# EAGLE design plant-sense (EAGLE 9.5.1)
CNAME: PepeTech; CREVISION: 2.0; DESIGNER: Joao Silva

## Sheet 1 of 4: Power
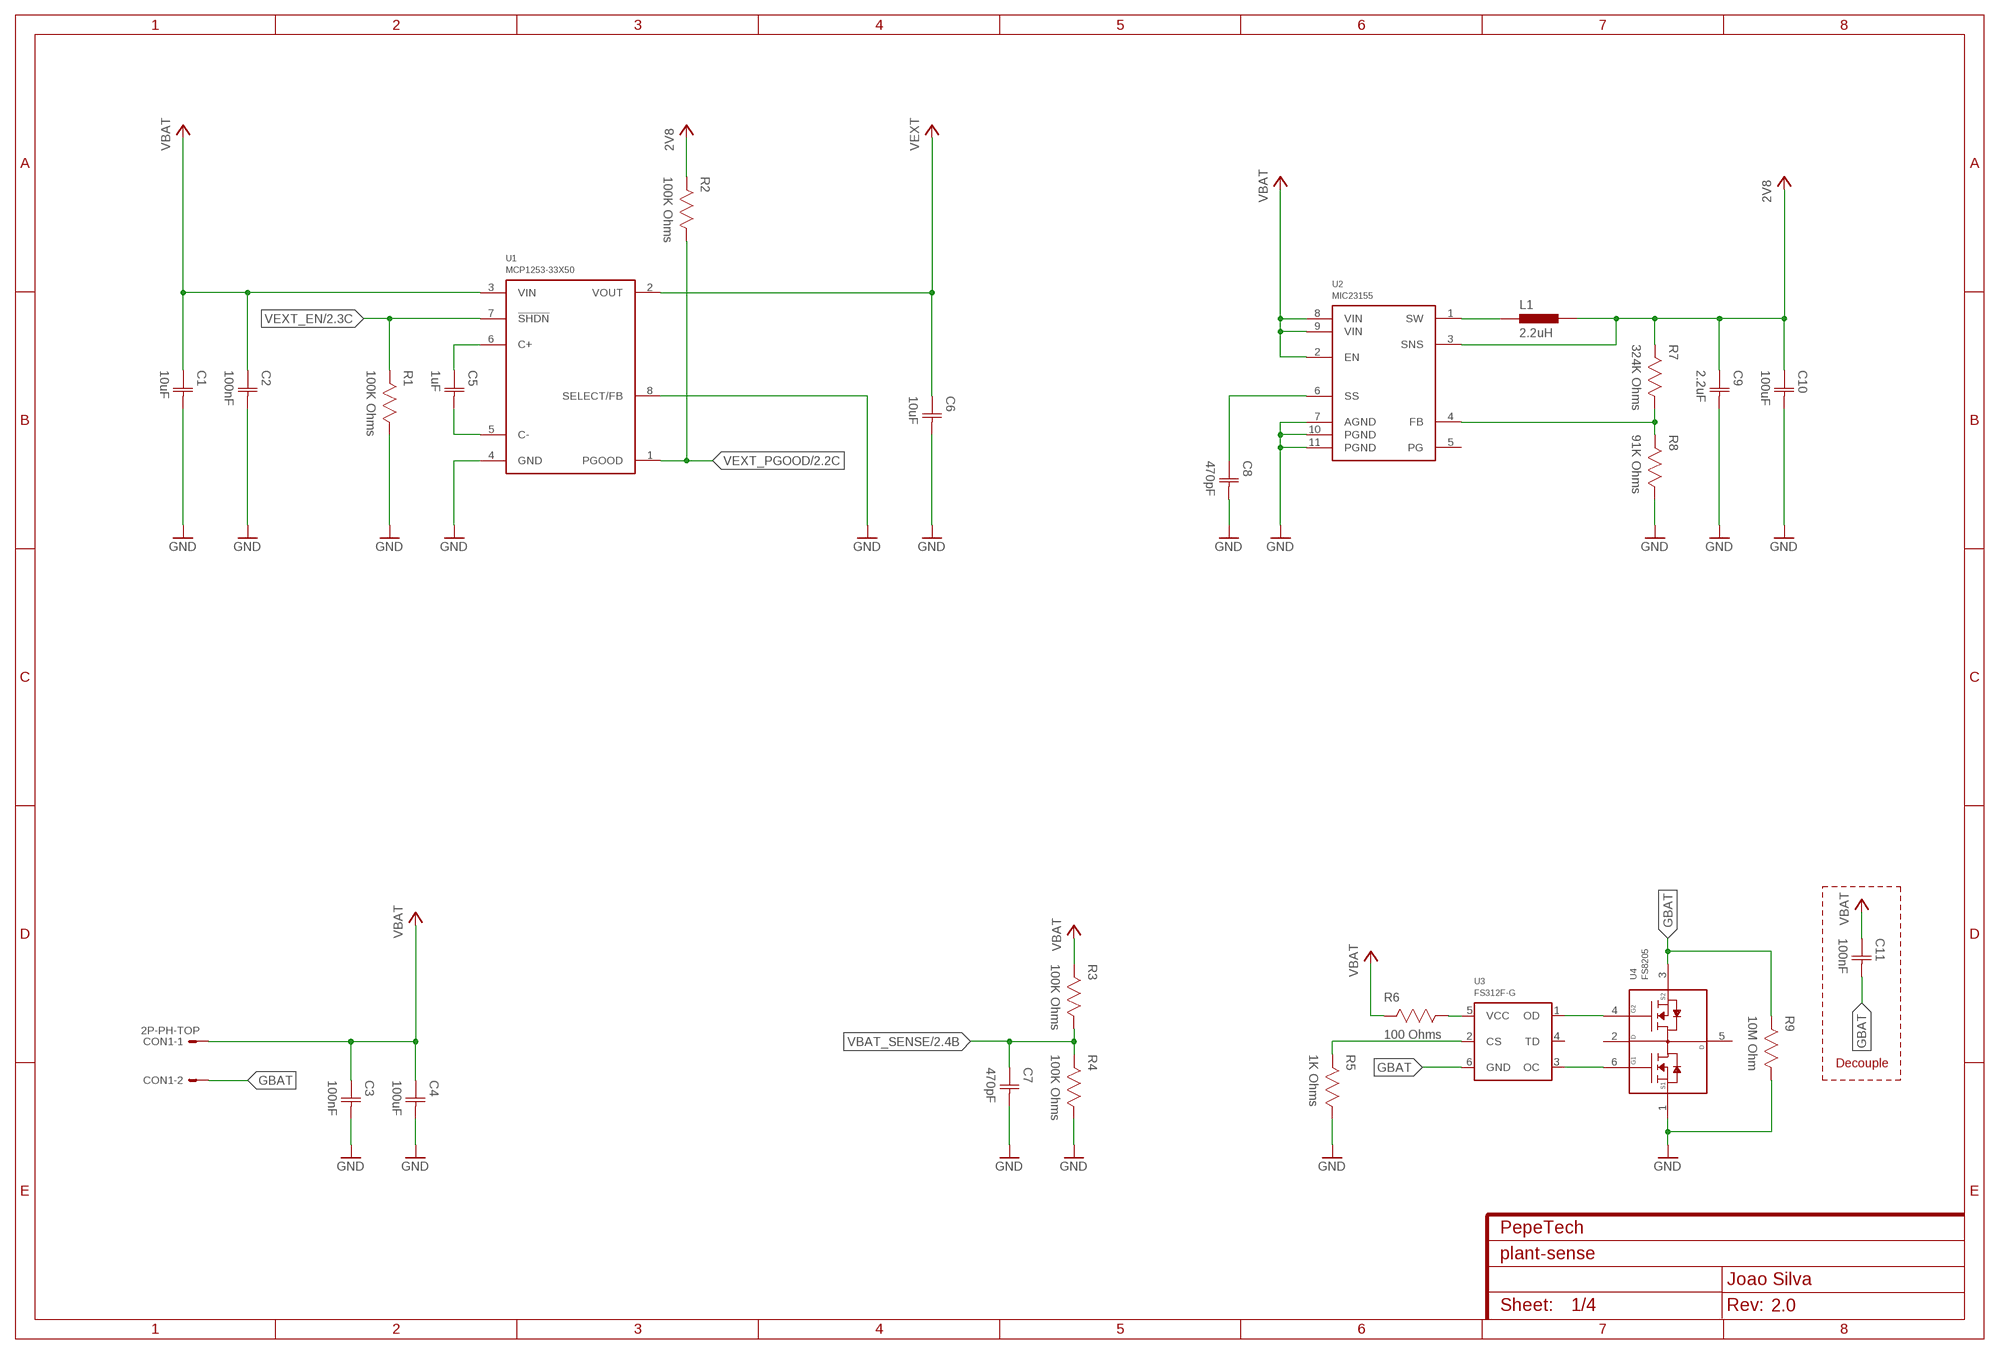
[diagram p0: schematic, sheet 1]

### Parts
C1  10uF  CAPACITOR-0603  [CAP0603]
C2  100nF  CAPACITOR-0603  [CAP0603]
C3  100nF  CAPACITOR-0603  [CAP0603]
C4  100uF  CAPACITOR-1206  [CAP1206]
C5  1uF  CAPACITOR-0603  [CAP0603]
C6  10uF  CAPACITOR-0603  [CAP0603]
C7  470pF  CAPACITOR-0603  [CAP0603]
C8  470pF  CAPACITOR-0603  [CAP0603]
C9  2.2uF  CAPACITOR-0603  [CAP0603]
C10  100uF  CAPACITOR-1206  [CAP1206]
C11  100nF  CAPACITOR-0603  [CAP0603]
CON1  2P-PH-TOP  [PH-02-TOP]
L1  2.2uH  INDUCTOR-0805  [IND0805]
R1  100K Ohms  RESISTOR-0603  [RES0603]
R2  100K Ohms  RESISTOR-0603  [RES0603]
R3  100K Ohms  RESISTOR-0603  [RES0603]
R4  100K Ohms  RESISTOR-0603  [RES0603]
R5  1K Ohms  RESISTOR-0603  [RES0603]
R6  100 Ohms  RESISTOR-0603  [RES0603]
R7  324K Ohms  RESISTOR-0603  [RES0603]
R8  91K Ohms  RESISTOR-0603  [RES0603]
R9  10M Ohm  RESISTOR-0603  [RES0603]
U1  MCP1253-33X50  [MSOP8]
U2  MIC23155  [DFN10]
U3  FS312F-G  [SOT23-6]
U4  FS8205  [SOT23-6]

### Nets
2V8: C9.1(C1) C10.1(C1) L1.2 R2.2 R7.2 U2.3(SNS) ; also sheet 2,3,4
GBAT: C11.2(C2) CON1.2 R9.2 U3.6(GND) U4.3(S2)
GND: C1.2(C2) C2.2(C2) C3.2(C2) C4.2(C2) C6.2(C2) C7.2(C2) C8.2(C2) C9.2(C2) C10.2(C2) R1.1 R4.1 R5.1 R8.1 R9.1 U1.4(GND) U1.8(SELECT/FB) U2.7(AGND) U2.10(PGND) U2.11(PGND) U4.1(S1) ; also sheet 2,3,4
N$2: C5.2(C2) U1.5(C-)
N$6: C5.1(C1) U1.6(C+)
N$12: L1.1 U2.1(SW)
N$13: R7.1 R8.2 U2.4(FB)
N$14: C8.1(C1) U2.6(SS)
N$47: U3.3(OC) U4.6(G1)
N$48: U3.1(OD) U4.4(G2)
N$49: R6.1 U3.5(VCC)
N$50: R5.2 U3.2(CS)
VBAT: C1.1(C1) C2.1(C1) C3.1(C1) C4.1(C1) C11.1(C1) CON1.1 R3.2 R6.2 U1.3(VIN) U2.2(EN) U2.8(VIN) U2.9(VIN)
VBAT_SENSE: C7.1(C1) R3.1 R4.2 ; also sheet 2
VEXT: C6.1(C1) U1.2(VOUT) ; also sheet 4
VEXT_EN: R1.2 U1.7(!SHDN) ; also sheet 2,4
VEXT_PGOOD: R2.1 U1.1(PGOOD) ; also sheet 2
Unconnected: U2.5(PG) U3.4(TD) U4.2(D12_1) U4.5(D12_2)

### Notes on the sheet
- Decouple

## Sheet 2 of 4: Main MCU
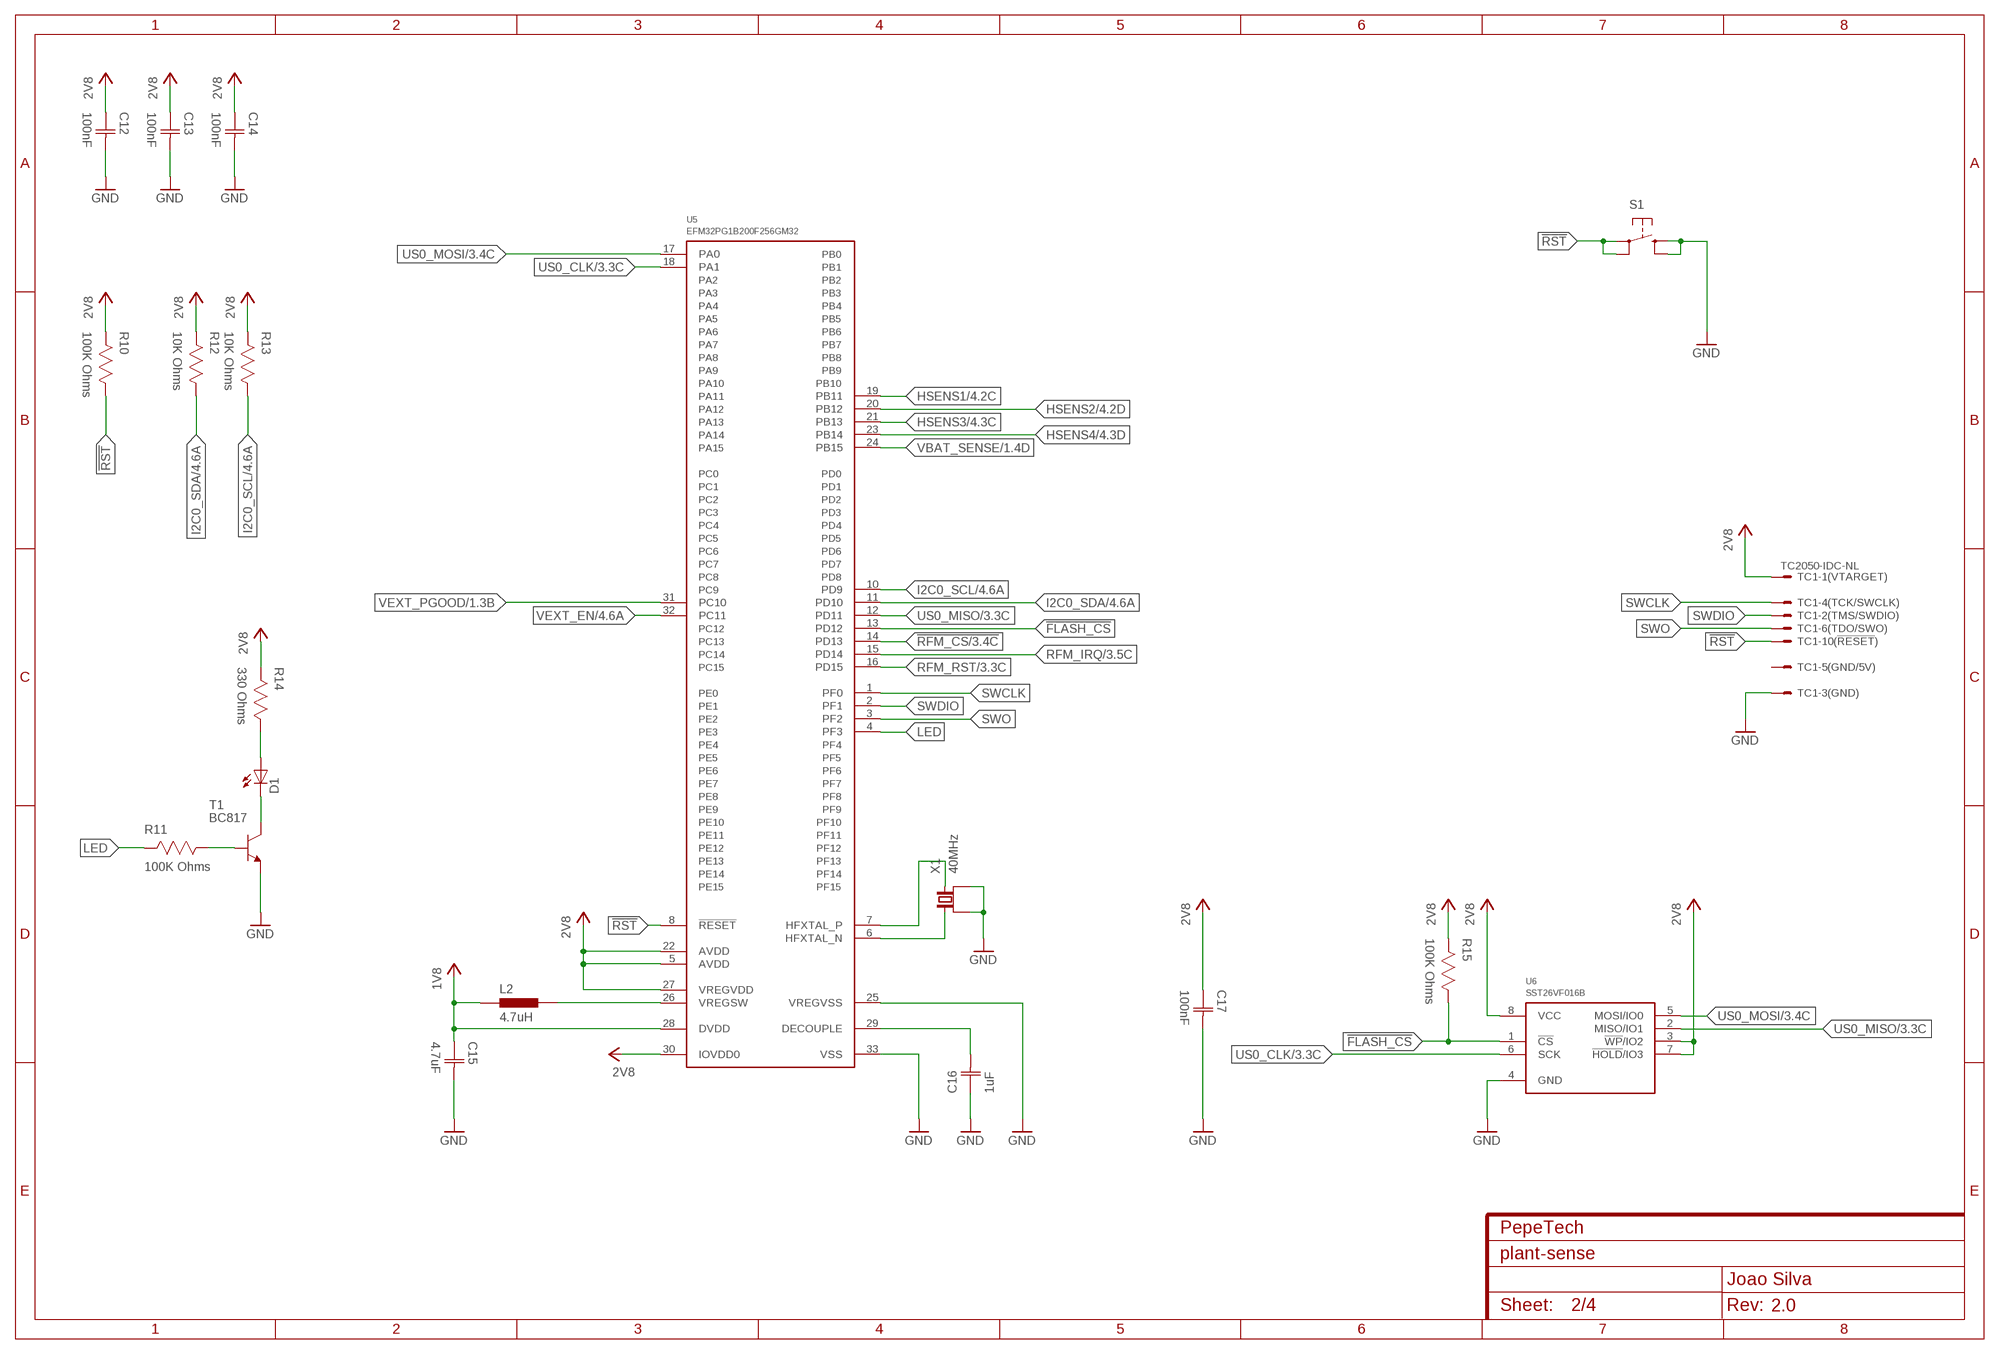
[diagram p1: schematic, sheet 2]

### Parts
C12  100nF  CAPACITOR-0603  [CAP0603]
C13  100nF  CAPACITOR-0603  [CAP0603]
C14  100nF  CAPACITOR-0603  [CAP0603]
C15  4.7uF  CAPACITOR-0603  [CAP0603]
C16  1uF  CAPACITOR-0603  [CAP0603]
C17  100nF  CAPACITOR-0603  [CAP0603]
D1  LED1206  [1206]
L2  4.7uH  INDUCTOR-0603  [IND0603]
R10  100K Ohms  RESISTOR-0603  [RES0603]
R11  100K Ohms  RESISTOR-0603  [RES0603]
R12  10K Ohms  RESISTOR-0603  [RES0603]
R13  10K Ohms  RESISTOR-0603  [RES0603]
R14  330 Ohms  RESISTOR-0603  [RES0603]
R15  100K Ohms  RESISTOR-0603  [RES0603]
S1  TAC_SWITCHSMD  [TAC_SW_SMD_RESET]
T1  BC817  [SOT23]
TC1  TC2050-IDC-NL  [TC2050-IDC-NL]
U5  EFM32PG1B200F256GM32  [QFN32_0.5P]
U6  SST26VF016B  [WSOIC8]
X1  40MHz  CRYSTAL_4P  [4-SMD-3225]

### Nets
1V8: C15.1(C1) L2.1 U5.28(DVDD)
2V8: C12.1(C1) C13.1(C1) C14.1(C1) C17.1(C1) R10.2 R12.2 R13.2 R14.2 R15.2 TC1.1 U5.5(AVDD) U5.22(AVDD) U5.27(VREGVDD) U5.30(IOVDD0) U6.3(!WP!/IO2) U6.7(!HOLD!/IO3) U6.8(VCC) ; also sheet 1,3,4
!FLASH_CS: R15.1 U5.13(PD12) U6.1(!CS!)
!RFM_CS: U5.14(PD13) ; also sheet 3
!RST: R10.1 S1.1 S1.2 TC1.10 U5.8(!RESET)
GND: C12.2(C2) C13.2(C2) C14.2(C2) C15.2(C2) C16.1(C1) C17.2(C2) S1.3 S1.4 T1.2(E) TC1.3 U5.25(VREGVSS) U5.33(VSS) U6.4(GND) X1.1(GND) X1.3(GND) ; also sheet 1,3,4
HSENS1: U5.19(PB11) ; also sheet 4
HSENS2: U5.20(PB12) ; also sheet 4
HSENS3: U5.21(PB13) ; also sheet 4
HSENS4: U5.23(PB14) ; also sheet 4
I2C0_SCL: R13.1 U5.10(PD9) ; also sheet 4
I2C0_SDA: R12.1 U5.11(PD10) ; also sheet 4
LED: R11.2 U5.4(PF3)
N$11: R11.1 T1.1(B)
N$15: D1.C T1.3(C)
N$16: U5.6(HFXTAL_N) X1.2
N$17: U5.7(HFXTAL_P) X1.4
N$18: D1.A R14.1
N$19: L2.2 U5.26(VREGSW)
N$20: C16.2(C2) U5.29(DECOUPLE)
RFM_IRQ: U5.15(PD14) ; also sheet 3
RFM_RST: U5.16(PD15) ; also sheet 3
SWCLK: TC1.4 U5.1(PF0)
SWDIO: TC1.2 U5.2(PF1)
SWO: TC1.6 U5.3(PF2)
US0_CLK: U5.18(PA1) U6.6(SCK) ; also sheet 3
US0_MISO: U5.12(PD11) U6.2(MISO/IO1) ; also sheet 3
US0_MOSI: U5.17(PA0) U6.5(MOSI/IO0) ; also sheet 3
VBAT_SENSE: U5.24(PB15) ; also sheet 1
VEXT_EN: U5.32(PC11) ; also sheet 1,4
VEXT_PGOOD: U5.31(PC10) ; also sheet 1
Unconnected: TC1.5 TC1.7 TC1.8 TC1.9

## Sheet 3 of 4: ISM Radio
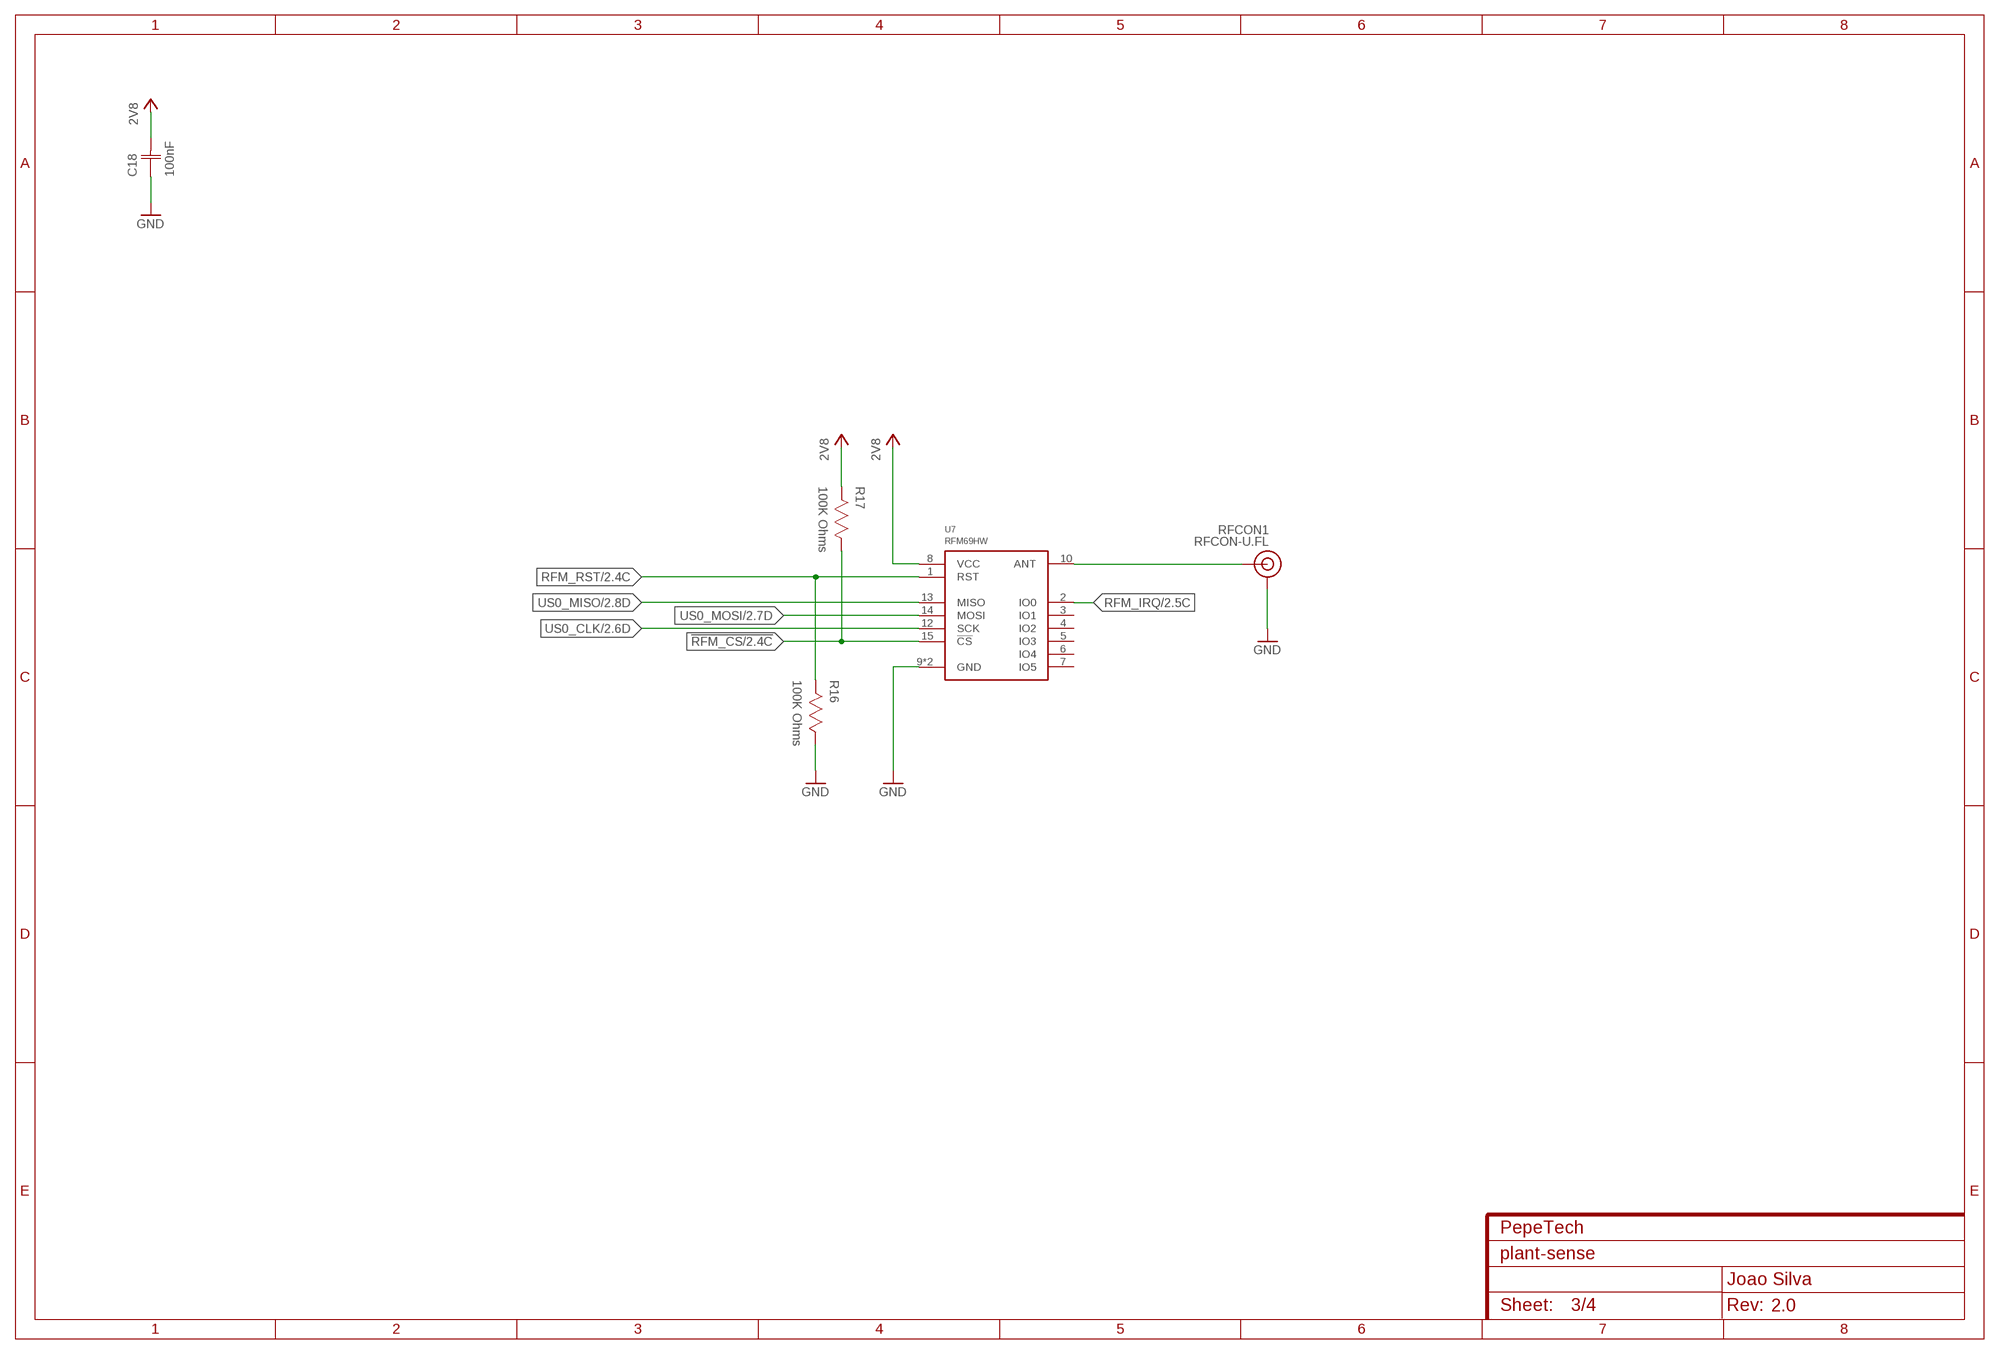
[diagram p2: schematic, sheet 3]

### Parts
C18  100nF  CAPACITOR-0603  [CAP0603]
R16  100K Ohms  RESISTOR-0603  [RES0603]
R17  100K Ohms  RESISTOR-0603  [RES0603]
RFCON1  RFCON-U.FL  [U.FL]
U7  RFM69HW  [RFM69XW-XXXS2]

### Nets
2V8: C18.2(C2) R17.2 U7.8(VCC) ; also sheet 1,2,4
!RFM_CS: R17.1 U7.15(!CS) ; also sheet 2
GND: C18.1(C1) R16.1 RFCON1.P$1(GND) RFCON1.P$2(GND) U7.9(GND) U7.11(GND) ; also sheet 1,2,4
N$1: RFCON1.P$3(SIGNAL) U7.10(ANT)
RFM_IRQ: U7.2(IO0) ; also sheet 2
RFM_RST: R16.2 U7.1(RST) ; also sheet 2
US0_CLK: U7.12(SCK) ; also sheet 2
US0_MISO: U7.13(MISO) ; also sheet 2
US0_MOSI: U7.14(MOSI) ; also sheet 2
Unconnected: U7.3(IO1) U7.4(IO2) U7.5(IO3) U7.6(IO4) U7.7(IO5)

## Sheet 4 of 4: Sensors/Interface
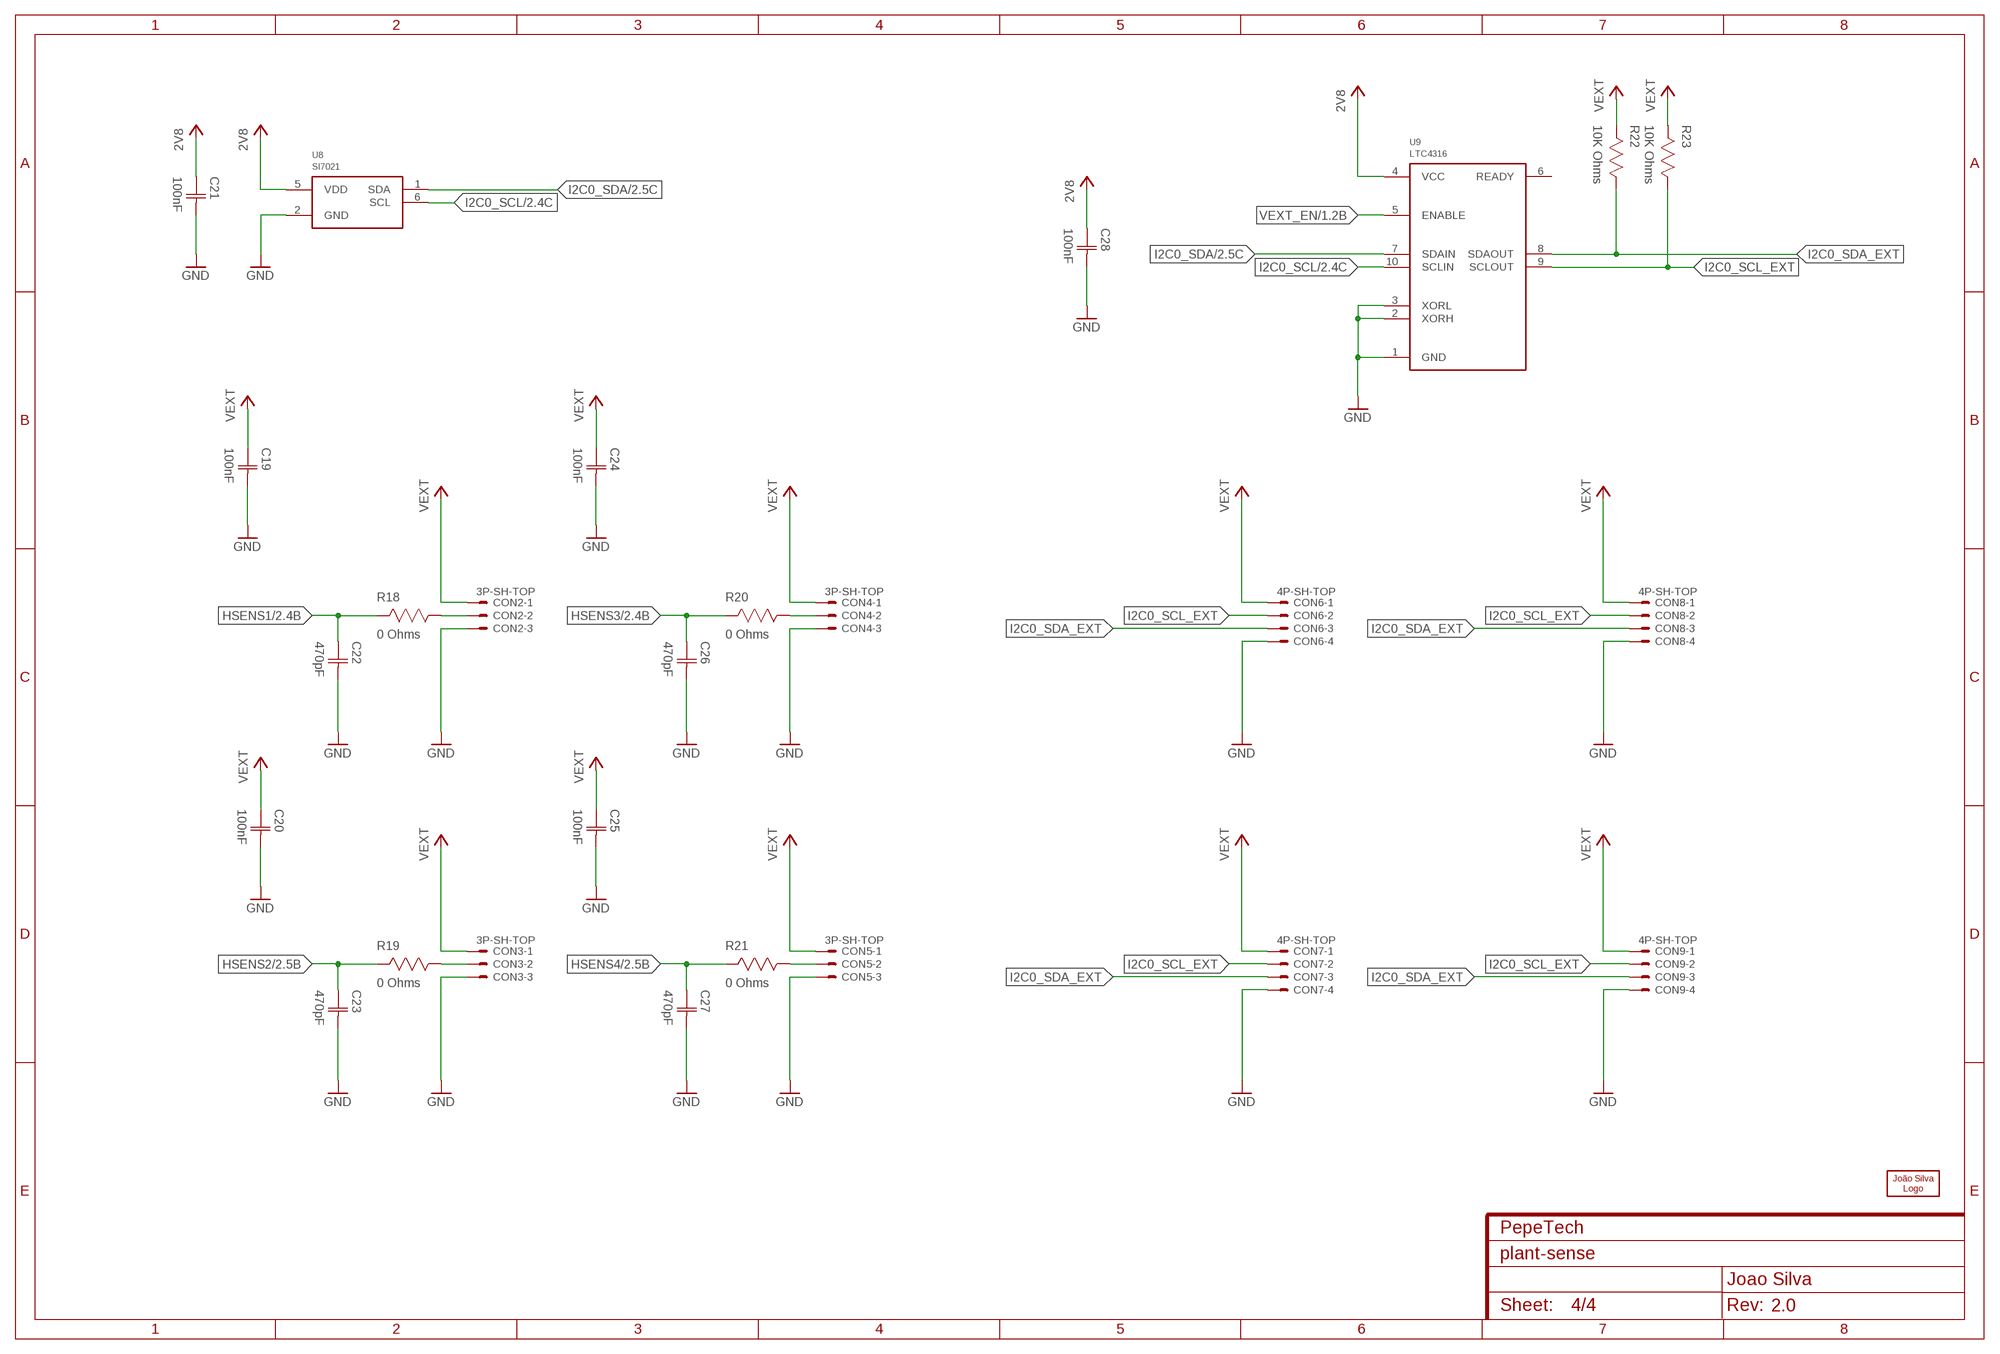
[diagram p3: schematic, sheet 4]

### Parts
C19  100nF  CAPACITOR-0603  [CAP0603]
C20  100nF  CAPACITOR-0603  [CAP0603]
C21  100nF  CAPACITOR-0603  [CAP0603]
C22  470pF  CAPACITOR-0603  [CAP0603]
C23  470pF  CAPACITOR-0603  [CAP0603]
C24  100nF  CAPACITOR-0603  [CAP0603]
C25  100nF  CAPACITOR-0603  [CAP0603]
C26  470pF  CAPACITOR-0603  [CAP0603]
C27  470pF  CAPACITOR-0603  [CAP0603]
C28  100nF  CAPACITOR-0603  [CAP0603]
CON2  3P-SH-TOP  [SH-03-TOP]
CON3  3P-SH-TOP  [SH-03-TOP]
CON4  3P-SH-TOP  [SH-03-TOP]
CON5  3P-SH-TOP  [SH-03-TOP]
CON6  4P-SH-TOP  [SH-04-TOP]
CON7  4P-SH-TOP  [SH-04-TOP]
CON8  4P-SH-TOP  [SH-04-TOP]
CON9  4P-SH-TOP  [SH-04-TOP]
LOGO1  JS-5MM  [JS_5MM]
R18  0 Ohms  RESISTOR-0603  [RES0603]
R19  0 Ohms  RESISTOR-0603  [RES0603]
R20  0 Ohms  RESISTOR-0603  [RES0603]
R21  0 Ohms  RESISTOR-0603  [RES0603]
R22  10K Ohms  RESISTOR-0603  [RES0603]
R23  10K Ohms  RESISTOR-0603  [RES0603]
U8  SI7021  [DFN6]
U9  LTC4316  [MSOP10]

### Nets
2V8: C21.1(C1) C28.1(C1) U8.5(VDD) U9.4(VCC) ; also sheet 1,2,3
GND: C19.2(C2) C20.2(C2) C21.2(C2) C22.2(C2) C23.2(C2) C24.2(C2) C25.2(C2) C26.2(C2) C27.2(C2) C28.2(C2) CON2.3 CON3.3 CON4.3 CON5.3 CON6.4 CON7.4 CON8.4 CON9.4 U8.2(GND) U9.1(GND) U9.2(XORH) U9.3(XORL) ; also sheet 1,2,3
HSENS1: C22.1(C1) R18.2 ; also sheet 2
HSENS2: C23.1(C1) R19.2 ; also sheet 2
HSENS3: C26.1(C1) R20.2 ; also sheet 2
HSENS4: C27.1(C1) R21.2 ; also sheet 2
I2C0_SCL: U8.6(SCL) U9.10(SCLIN) ; also sheet 2
I2C0_SCL_EXT: CON6.2 CON7.2 CON8.2 CON9.2 R23.1 U9.9(SCLOUT)
I2C0_SDA: U8.1(SDA) U9.7(SDAIN) ; also sheet 2
I2C0_SDA_EXT: CON6.3 CON7.3 CON8.3 CON9.3 R22.1 U9.8(SDAOUT)
N$7: CON3.2 R19.1
N$8: CON4.2 R20.1
N$9: CON2.2 R18.1
N$10: CON5.2 R21.1
VEXT: C19.1(C1) C20.1(C1) C24.1(C1) C25.1(C1) CON2.1 CON3.1 CON4.1 CON5.1 CON6.1 CON7.1 CON8.1 CON9.1 R22.2 R23.2 ; also sheet 1
VEXT_EN: U9.5(ENABLE) ; also sheet 1,2
Unconnected: U9.6(READY)

## Library data of the parts
C1-C28 = Capacitor:CAPACITOR
CON1 = JST:2P: Disconnectable Crimp style connector, 1.0mm pitch 2 contacts
CON2-CON5 = JST:3P: Disconnectable Crimp style connector, 1.0mm pitch 3 contacts
CON6-CON9 = JST:4P: Disconnectable Crimp style connector, 1.0mm pitch 4 contacts
D1 = LED:LED
L1 = Inductor:INDUCTOR; OCLCSC: C139241
L2 = Inductor:INDUCTOR; OCLCSC: C281111
LOGO1 = Silkscreen:JS
R1-R23 = Resistor:RESISTOR
RFCON1 = RF Connector:RFCON
S1 = Switch:TAC_SWITCH: Momentary Switch Button commonly used for reset or general input. Spark Fun Electronics SKU : COM-00097
T1 = Generic BJT:BC817
TC1 = TagConnect:TC2050-IDC
U1 = Microchip:MCP125*
U2 = Microchip:MIC23155
U3 = Fortune:FS312F-G
U4 = Fortune:FS8205
U5 = EFM32:EFM32PG1B200F*M32
U6 = Microchip:SST26VF016B
U7 = HopeRF:RFM69*
U8 = Silicon Labs:SI7021
U9 = Analog Devices:LTC4316
X1 = Crystal:CRYSTAL_4P

## Board
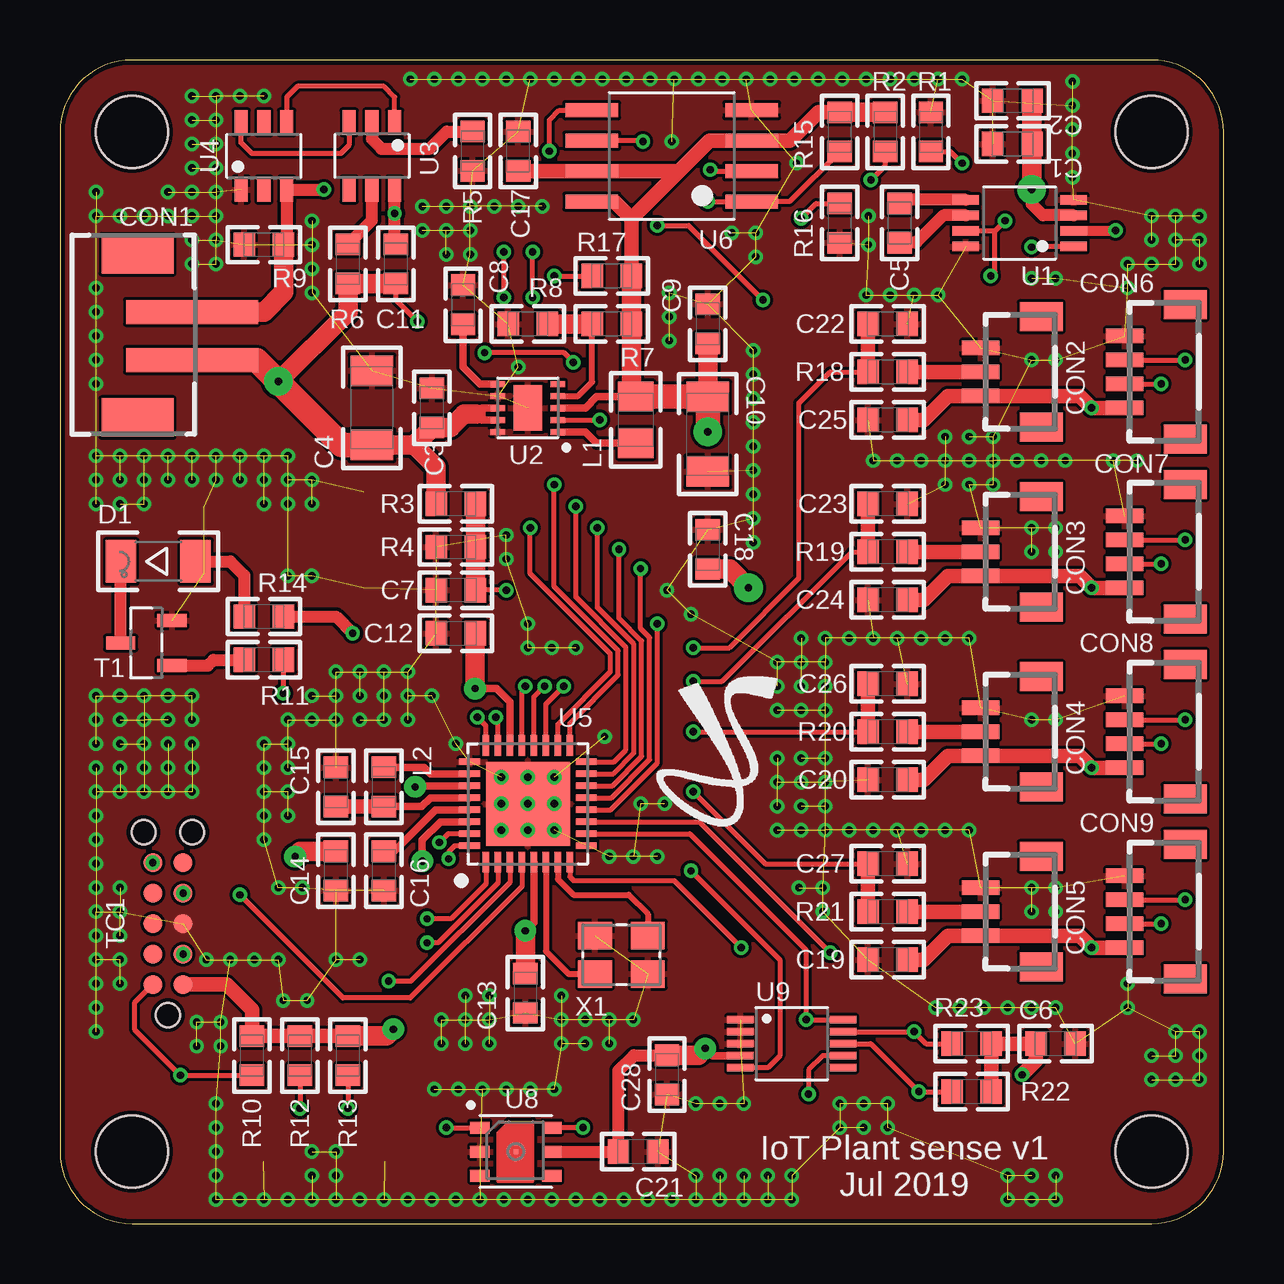
[diagram p4: board, top side]
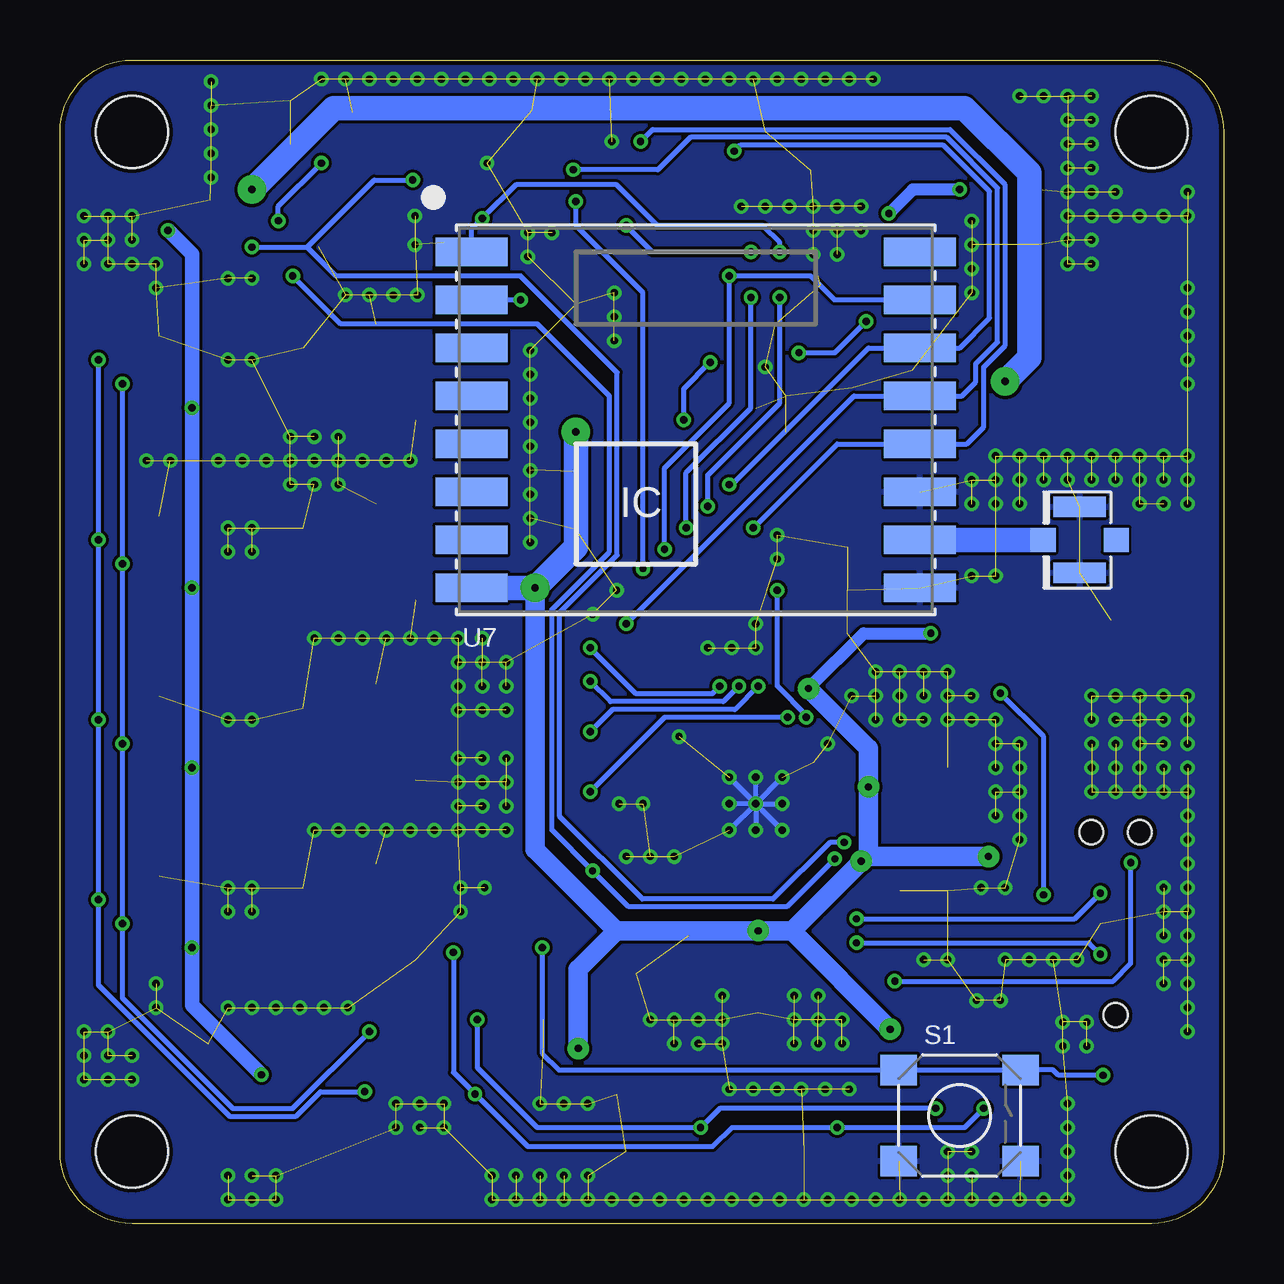
[diagram p5: board, bottom side, seen from below]

Size 48.5 x 48.5 mm. Coordinates in mm from the lower left corner, seen from the top.
Outline: 0,45.5 0,3 arc90 3,0 45.5,0 arc90 48.5,3 48.5,45.5 arc90 45.5,48.5 3,48.5 arc90 0,45.5
Copper layers (1*16): Top 0.035mm / dielectric 1.6mm / Bottom 0.035mm
Design rules "jlcpcb_2layer": minimum track width 5mil, minimum drill 0.3mm, track to track 5mil, track to pad 5mil, pad to pad 5mil, via to via 5mil, smd to smd 5mil, copper to edge 0.2mm, drill to drill 5mil, minimum pad ring 3mil, minimum via ring 3mil, stop-mask expansion 0.075mm, vias tented up to drill 10mm, thermal gap 5mil
Holes 3 mm at 3,45.5 45.5,45.5 45.5,3 3,3

### Footprints (pad centres in the part's own frame; a part is rotated, then mirrored left to right if it is on the bottom)
CAP0603 = smd 0.889 x 1.016: 1 -0.819,0; 2 0.819,0
CAP1206 = smd 1.27 x 1.778: 1 -1.549,0; 2 1.549,0
PH-02-TOP = smd 1 x 5.5: 1 -1,-2; 2 1,-2 | smd 1.6 x 3: P$1 -3.4,0.27; P$2 3.4,0.27
SH-03-TOP = smd 0.6 x 1.55: 1 1,-1.625; 2 0,-1.625; 3 -1,-1.625 | smd 1.2 x 1.8: FIT@1 2.3,0.9; FIT@2 -2.3,0.9
SH-04-TOP = smd 0.6 x 1.55: 1 1.5,-1.625; 2 0.5,-1.625; 3 -0.5,-1.625; 4 -1.5,-1.625 | smd 1.2 x 1.8: FIT@1 2.8,0.9; FIT@2 -2.8,0.9
1206 = smd 1.27 x 1.778: A 1.549,0; C -1.549,0
IND0805 = smd 1.245 x 1.473: 1 -0.965,0; 2 0.965,0
IND0603 = smd 0.889 x 1.016: 1 -0.819,0; 2 0.819,0
RES0603 = smd 0.889 x 1.016: 1 -0.819,0; 2 0.819,0
U.FL = smd 2.2 x 0.85: P$1 0,1.375; P$2 0,-1.375 | smd 1.05 x 1: P$3 1.525,0; P$4 -1.525,0
TAC_SW_SMD_RESET = smd 1.524 x 1.27: 1 -2.54,1.905; 2 2.54,1.905; 3 -2.54,-1.905; 4 2.54,-1.905
SOT23 = smd 1.219 x 0.533: 1 -1.067,0.94; 2 -1.067,-0.94; 3 1.067,0
TC2050-IDC-NL = smd 0.787 x 0.787: 1 -2.54,-0.635; 2 -1.27,-0.635; 3 0,-0.635; 4 1.27,-0.635; 5 2.54,-0.635; 6 2.54,0.635; 7 1.27,0.635; 8 0,0.635; 9 -1.27,0.635; 10 -2.54,0.635 | hole 0.991: -3.81,0; 3.81,1.016; 3.81,-1.016
MSOP8 = smd 0.4 x 1.1: 1 -0.975,-2.25; 2 -0.325,-2.25; 3 0.325,-2.25; 4 0.975,-2.25; 5 0.975,2.25; 6 0.325,2.25; 7 -0.325,2.25; 8 -0.975,2.25
DFN10 = smd 0.6 x 0.25: 1 -1.25,1; 2 -1.25,0.5; 3 -1.25,0; 4 -1.25,-0.5; 5 -1.25,-1; 6 1.25,-1; 7 1.25,-0.5; 8 1.25,0; 9 1.25,0.5; 10 1.25,1 | smd 1.2 x 1.9: 11 0,0
SOT23-6 = smd 1 x 0.55: 1 -1.4,0.95; 2 -1.4,0; 3 -1.4,-0.95; 4 1.4,-0.95; 5 1.4,0; 6 1.4,0.95
QFN32_0.5P = smd 0.86 x 0.26: 1 -2.43,1.75; 2 -2.43,1.25; 3 -2.43,0.75; 4 -2.43,0.25; 5 -2.43,-0.25; 6 -2.43,-0.75; 7 -2.43,-1.25; 8 -2.43,-1.75; 17 2.43,-1.75; 18 2.43,-1.25; 19 2.43,-0.75; 20 2.43,-0.25; 21 2.43,0.25; 22 2.43,0.75; 23 2.43,1.25; 24 2.43,1.75 | smd 0.26 x 0.86: 9 -1.75,-2.43; 10 -1.25,-2.43; 11 -0.75,-2.43; 12 -0.25,-2.43; 13 0.25,-2.43; 14 0.75,-2.43; 15 1.25,-2.43; 16 1.75,-2.43; 25 1.75,2.43; 26 1.25,2.43; 27 0.75,2.43; 28 0.25,2.43; 29 -0.25,2.43; 30 -0.75,2.43; 31 -1.25,2.43; 32 -1.75,2.43 | smd 3.5 x 3.5: 33 0,0
WSOIC8 = smd 0.6 x 2.2: 1 -1.905,-3.33; 2 -0.635,-3.33; 3 0.635,-3.33; 4 1.905,-3.33; 5 1.905,3.33; 6 0.635,3.33; 7 -0.635,3.33; 8 -1.905,3.33
RFM69XW-XXXS2 = smd 3 x 1.2: 1 -9.35,7; 2 -9.35,5; 3 -9.35,3; 4 -9.35,1; 5 -9.35,-1; 6 -9.35,-3; 7 -9.35,-5; 8 -9.35,-7; 9 9.35,-7; 10 9.35,-5; 11 9.35,-3; 12 9.35,-1; 13 9.35,1; 14 9.35,3; 15 9.35,5; 16 9.35,7
DFN6 = smd 0.8 x 0.5: 1 1.5,-1; 2 1.5,0; 3 1.5,1; 4 -1.5,1; 5 -1.5,0; 6 -1.5,-1 | smd 0.2 x 0.2: 7 0,0
MSOP10 = smd 0.3 x 1.1: 1 -1,-2.14; 2 -0.5,-2.14; 3 0,-2.14; 4 0.5,-2.14; 5 1,-2.14; 6 1,2.14; 7 0.5,2.14; 8 0,2.14; 9 -0.5,2.14; 10 -1,2.14
4-SMD-3225 = smd 1.4 x 1.15: 1 -1.1,0.8; 2 1.1,0.8; 3 1.1,-0.8; 4 -1.1,-0.8

### Placement (x,y rotation side)
C1  39.7,45 180 top
C2  39.7,46.8 180 top
C3  15.5,34 90 top
C4  13,34 90 top
C5  35,41.7 90 top
C6  41.5,7.5 0 top
C7  16.5,26.4 180 top
C8  16.8,38.3 90 top
C9  27,37.5 90 top
C10  27,32.9 270 top
C11  14,40 90 top
C12  16.5,24.6 180 top
C13  19.4,9.6 270 top
C14  11.5,14.7 270 top
C15  11.5,18.2 90 top
C16  13.5,14.7 90 top
C17  19.1,44.7 90 top
C18  27,28.1 270 top
C19  34.5,11 180 top
C20  34.5,18.5 180 top
C21  24.1,3 0 top
C22  34.5,37.5 0 top
C23  34.5,30 0 top
C24  34.5,26 180 top
C25  34.5,33.5 180 top
C26  34.5,22.5 0 top
C27  34.5,15 0 top
C28  25.3,6.2 270 top
CON1  3.5,37 90 top
CON2  40,35.5 270 top
CON3  40,28 270 top
CON4  40,20.5 270 top
CON5  40,13 270 top
CON6  46,35.5 270 top
CON7  46,28 270 top
CON8  46,20.5 270 top
CON9  46,13 270 top
D1  4.1,27.6 0 top
L1  24,33.5 90 top
L2  13.5,18.2 90 top
LOGO1  30.1,23 0 top
R1  36.3,45.5 270 top
R2  34.4,45.5 90 top
R3  16.5,30 180 top
R4  16.5,28.2 0 top
R5  17.2,44.7 90 top
R6  12,40 270 top
R7  23,37.5 0 top
R8  19.5,37.5 0 top
R9  8.5,40.8 0 top
R10  8,7 90 top
R11  8.5,23.5 0 top
R12  10,7 90 top
R13  12,7 90 top
R14  8.5,25.3 0 top
R15  32.5,45.5 90 top
R16  32.5,41.7 90 top
R17  23,39.5 0 top
R18  34.5,35.5 180 top
R19  34.5,28 180 top
R20  34.5,20.5 180 top
R21  34.5,13 180 top
R22  38,5.5 0 top
R23  38,7.5 0 top
RFCON1  6,28.5 180 bottom
S1  11,4.5 0 bottom
T1  3.6,24.2 180 top
TC1  4.5,12.5 90 top
U1  40,41.7 90 top
U2  19.5,34 180 top
U3  13,44.5 270 top
U4  8.5,44.5 90 top
U5  19.5,17.5 90 top
U6  25.5,44.5 90 top
U7  22,33.5 0 bottom
U8  19,3 180 top
U9  30.5,7.5 270 top
X1  23.4,11.2 180 top

### Tracks (layer width: path | path; a pad name or v marks a point on that pad's centre or on a via)
1V8
  Top 0.305: U5.28 15.45,17.75 15.08,17.38 L2.1
  Top 0.61: C15.1 L2.1
2V8  (via drill 0.3, 0.3 pad 0.9, 0.3 pad 1.2)
  Top 0.305: U2.3 21.9,34 22.36,34.47 L1.2 | U5.30 15.86,16.75 15.1,15.99 v15.1,15.1 | v14.8,18.2 14.85,18.25 U5.27 | U5.22 18.75,21.75 18.2,22.3 v17.3,22.3 | U5.5 19.75,12.55 v19.4,12.2 | U9.4 27.2,7 v26.9,7.3
  Top 0.508: U8.5 C21.1 23.28,6.38 23.92,7.02 C28.1 | R14.2 11.5,25.3 v12.2,24.6
  Top 0.61: TC1.1 6.94,9.96 8,8.9 R10.2 R12.2 R13.2 | U6.8 23.11,42.59 23.82,41.88 | R17.2 23.82,41.88 | 23.82,41.88 25.8,43.87 | R15.2 31.62,46.32 30.43,45.13 U6.3 27.07,45.13 25.8,43.87 | 25.8,43.87 U6.7 19.12,43.87 C17.1
  Top 0.813: L1.2 23.82,34.65 R7.2 R17.2 | R15.2 R2.2 | C9.1 C10.1 | v28.7,26.5 27.92,27.28 C18.2 | v19.4,12.2 C13.1 | v17.3,22.3 17.3,24.58 C12.1 | R13.2 13.62,7.82 v13.9,8.1 | v26.9,7.3 26.62,7.02 C28.1 | v9.8,15.3 10.02,15.52 C14.1
  Top 1.016: L1.2 26.98,34.47 C10.1 v27,33
  Bottom 0.508: v12.2,24.6 15,24.6 v17.3,22.3
  Bottom 0.813: v28.7,26.5 28.7,15.6 25.3,12.2 | 25.3,12.2 v19.4,12.2 18,12.2 | 18,12.2 v15.1,15.1 | v15.1,15.1 14.8,15.4 v14.8,18.2 14.8,19.8 v17.3,22.3 | v13.9,8.1 18,12.2 | 25.3,12.2 26.9,10.6 v26.9,7.3 | v15.1,15.1 14.9,15.3 v9.8,15.3
  Bottom 1.016: v27,33 27,28.2 v28.7,26.5 U7.8
!FLASH_CS  (via drill 0.3)
  Top 0.2: R15.1 30.41,42.59 U6.1 v27,42.6 | U5.13 22.99,17.75 24.57,19.34 24.57,24.43 24.2,24.8 v24.2,27.3
  Bottom 0.2: v24.2,27.3 24.2,38.8 27,41.6 v27,42.6
!RFM_CS  (via drill 0.3)
  Top 0.2: v20.6,39.5 R17.1 | U5.14 23.02,18.25 24.25,19.47 24.25,24.29 23.3,25.24 v23.3,28.1
  Bottom 0.2: U7.15 16.2,38.5 17.2,39.5 v20.6,39.5 20.6,34.2 23.3,31.5 v23.3,28.1
!RST  (via drill 0.3)
  Top 0.2: TC1.10 3.1,9.2 3.1,8.1 v5.02,6.18 R10.1 | U5.8 21.25,14.45 21.4,14.3 25.6,14.3 v28.4,11.5
  Bottom 0.2: v5.02,6.18 6.88,6.18 7.11,6.41 S1.2 S1.1 27.7,6.41 28.4,7.1 v28.4,11.5
GBAT  (via drill 0.3)
  Top 0.508: R9.2 9.45,40.93 U4.3 v11,43.1 | C11.2 13.95,40.87 v13.95,42.1 U3.6
  Top 0.813: CON1.2 8.5,38 9.32,38.82 R9.2
  Bottom 0.508: v11,43.1 12.95,43.1 v13.95,42.1
GND  (via drill 0.3)  (451 unrouted)
  Bottom 0.2: U5.33 v20.6,18.6 | U5.33 v19.5,18.6 | U5.33 v18.4,18.6 | U5.33 v18.4,17.5 | U5.33 v20.6,17.5 | U5.33 v19.5,16.4 | U5.33 v20.6,16.4 | U5.33 v18.4,16.4
  other vias: 19.5,17.5 19.1,35.7 1.5,22 2.5,22 3.5,22 4.5,22 5.5,22 1.5,18 2.5,18 3.5,18 4.5,18 5.5,18 1.5,19 2.5,19 3.5,19 4.5,19 5.5,19 1.5,20 2.5,20 3.5,20 4.5,20 5.5,20 1.5,21 2.5,21 3.5,21 4.5,21 5.5,21 8.5,20 8.5,16 8.5,17 8.5,18 8.5,19 11.5,23 15.5,22 14.5,23 13.5,23 12.5,23 10.5,22 14.5,22 13.5,22 12.5,22 11.5,22 10.5,21 14.5,21 13.5,21 12.5,21 11.5,21 9.5,21 9.5,17 9.5,18 9.5,19 9.5,20 5.5,43 5.5,47 5.5,46 5.5,45 5.5,44 1.5,42 5.5,42 4.5,42 3.5,42 2.5,42 1.5,39 1.5,35 1.5,36 1.5,37 1.5,38 6.5,47 4.5,43 1.5,43 6.5,40 5.5,40 5.5,41 6.5,41 6.5,42 6.5,43 6.5,44 6.5,45 6.5,46 7.5,47 8.5,47 14.6,47.7 15.6,47.7 16.6,47.7 17.6,47.7 34.6,47.7 35.6,47.7 36.6,47.7 37.6,47.7 30.6,47.7 31.6,47.7 32.6,47.7 33.6,47.7 22.6,47.7 23.6,47.7 24.6,47.7 25.6,47.7 26.6,47.7 27.6,47.7 28.6,47.7 29.6,47.7 18.6,47.7 19.6,47.7 20.6,47.7 21.6,47.7 42.2,44.6 42.2,45.6 42.2,46.6 42.2,47.6 42.2,43.6 45.5,40 46.5,40 47.5,40 45.5,41 46.5,41 47.5,41 45.5,42 46.5,42 47.5,42 44.5,39 44.5,40 40.5,36 41.5,36 40.5,28 41.5,28 40.5,29 41.5,29 40.5,21 41.5,21 40.5,14 41.5,14 40.5,13 41.5,13 1.5,17 1.5,13 1.5,14 1.5,15 1.5,16 1.5,12 1.5,8 1.5,9 1.5,10 1.5,11 6.5,1 10.5,1 9.5,1 8.5,1 7.5,1 11.5,1 15.5,1 14.5,1 13.5,1 12.5,1 16.5,1 20.5,1 19.5,1 18.5,1 17.5,1 21.5,1 25.5,1 24.5,1 23.5,1 22.5,1 26.5,1 30.5,1 29.5,1 28.5,1 27.5,1 26.5,2 30.5,2 29.5,2 28.5,2 27.5,2 26.5,5 28.5,5 27.5,5 15.6,5.6 16.6,5.6 20.6,5.6 19.6,5.6 18.6,5.6 17.6,5.6 15.9,7.5 16.9,7.5 17.9,7.5 15.9,8.5 16.9,8.5 17.9,8.5 16.9,9.5 17.9,9.5 22.9,7.5 21.9,7.5 23.9,8.5 22.9,8.5 21.9,8.5 20.9,7.5 20.9,8.5 20.9,9.5 11.5,11 12.5,11 6.1,11 7.1,11 8.1,11 9.1,11 9.3,9.3 10.3,9.3 6.7,7.4 6.7,8.4 5.7,7.4 5.7,8.4 10.5,3 11.5,3 10.5,2 11.5,2 6.5,5 6.5,3 6.5,2 6.5,4 29.9,16.4 30.9,16.4 31.9,16.4 29.9,17.4 30.9,17.4 31.9,17.4 29.9,18.4 30.9,18.4 31.9,18.4 29.9,19.4 30.9,19.4 31.9,19.4 24.2,17.5 25.2,17.5 22.9,15.3 23.9,15.3 24.9,15.3 29.9,21.4 30.9,21.4 31.9,21.4 29.9,22.4 30.9,22.4 31.9,22.4 29.9,23.4 30.9,23.4 31.9,23.4 30.9,24.4 31.9,24.4 35.9,16.4 36.9,16.4 37.9,16.4 32.9,16.4 33.9,16.4 34.9,16.4 35.9,24.4 36.9,24.4 37.9,24.4 32.9,24.4 33.9,24.4 34.9,24.4 41.5,1 40.5,1 39.5,1 41.5,2 40.5,2 39.5,2 47.5,8 46.5,8 47.5,6 46.5,6 45.5,6 47.5,7 46.5,7 45.5,7 38.5,9 37.5,9 36.5,9 41.5,9 40.5,9 39.5,9 44.5,9 44.5,10 31.8,14 30.8,14 31.8,13 6.5,32 7.5,32 8.5,32 9.5,32 8.5,30 9.5,30 10.5,30 6.5,31 7.5,31 8.5,31 9.5,31 10.5,31 1.5,32 2.5,32 3.5,32 4.5,32 5.5,32 1.5,30 2.5,30 3.5,30 1.5,31 2.5,31 3.5,31 4.5,31 5.5,31 9.5,27 10.5,27 19.5,25 19.5,24 20.5,24 28.9,34.4 28.9,35.4 28.9,36.4 28.9,31.4 28.9,32.4 28.9,33.4 28.9,28.4 28.9,29.4 28.9,30.4 25.4,36.8 25.4,37.8 25.4,38.8 17.1,41.4 16.1,41.4 15.1,41.4 17.1,42.4 16.1,42.4 15.1,42.4 20.1,42.4 19.1,42.4 18.1,42.4 17.1,40.4 16.1,40.4 10.5,40.8 10.5,39.8 10.5,38.8 10.5,41.8 29,40.3 29,41.3 28,41.3 35.9,31.8 34.9,31.8 33.9,31.8 38.9,31.8 37.9,31.8 36.9,31.8 44.9,31.8 43.9,31.8 41.9,31.8 40.9,31.8 39.9,31.8 38.9,32.8 37.9,32.8 36.9,32.8 38.9,30.8 37.9,30.8 36.9,30.8 41.5,39.4 40.5,39.4 25.5,45.1 30.7,44.2 33.7,42 33.7,40.8 33.6,38.7 34.6,38.7 35.6,38.7 36.6,38.7 18.6,28.7 18.6,27.7 25.3,26.4 26.3,25.4 21.5,24 16.5,20 9.1,14 10.1,14 2.5,13 2.5,14 2.5,12 2.5,10 2.5,11 34.5,5 33.5,5 32.5,5 34.5,4 33.5,4 32.5,4 22.7,20.3
  pour Top: 53.5,53.5 53.5,-4.5 5,-4.5 -5,-4.5 -5,51.5 -5,53.5
  pour Bottom: 55,55 55,-6 -7,-6 -7,55
HSENS1  (via drill 0.3)
  Top 0.2: U5.19 20.25,21.65 v21,22.4 | v26.4,24 27.9,24 30.8,26.9 30.8,34.2 32.1,35.5 R18.2
  Top 0.61: C22.1 R18.2
  Bottom 0.2: v21,22.4 21.32,22.08 24.48,22.08 v26.4,24
HSENS2  (via drill 0.3)
  Top 0.2: U5.20 19.75,21.95 v20.2,22.4 | v26.4,22.6 27.6,22.6 33,28 R19.2
  Top 0.61: C23.1 R19.2
  Bottom 0.2: v20.2,22.4 20.85,21.75 25.55,21.75 v26.4,22.6
HSENS3  (via drill 0.3)
  Top 0.2: U5.21 19.25,22.25 v19.4,22.4 | v26.4,20.5 R20.2
  Top 0.61: C26.1 R20.2
  Bottom 0.2: v26.4,20.5 25.47,21.43 20.37,21.43 v19.4,22.4
HSENS4  (via drill 0.3)
  Top 0.2: U5.23 18.25,21.02 v18.17,21.1 | v26.4,18 29.4,15 C27.1
  Top 0.61: C27.1 R21.2
  Bottom 0.2: v18.17,21.1 23.3,21.1 v26.4,18
I2C0_SCL  (via drill 0.3)
  Top 0.2: R13.1 v12,4.8 | v21.8,4 U8.6 | U9.10 v31.1,8.5 31.1,11.4 26.25,16.25 U5.10
  Bottom 0.2: v12,4.8 21,4.8 v21.8,4 28.6,4 31.1,6.5 v31.1,8.5
I2C0_SCL_EXT  (via drill 0.3)
  Top 0.2: U9.9 v35.6,8 36.1,7.5 R23.1 | CON6.2 v45.9,35 | CON7.2 v45.9,27.5 | CON8.2 v45.9,20 | CON9.2 v45.9,12.5
  Bottom 0.2: v45.9,35 v45.9,27.5 v45.9,20 v45.9,12.5 45.9,9.4 41.3,4.8 38.8,4.8 v35.6,8
I2C0_SDA  (via drill 0.3)
  Top 0.2: R12.1 v10,4.8 | v16.1,4 U8.1 | U9.7 31.8,7 31.2,6.4 v31.2,5.4 | U5.11 26.65,16.75 v32.1,11.3
  Bottom 0.2: v10,4.8 10.8,4 v16.1,4 20.5,4 21.3,3.2 29,3.2 v31.2,5.4 32.1,6.3 v32.1,11.3
I2C0_SDA_EXT  (via drill 0.3)
  Top 0.2: U9.8 33.8,7.5 v35.8,5.5 R22.1 | CON6.3 v46.9,36 | CON7.3 v46.9,28.5 | CON8.3 v46.9,21 | CON9.3 v46.9,13.5
  Bottom 0.2: v46.9,36 v46.9,28.5 v46.9,21 v46.9,13.5 46.9,9.94 41.44,4.47 38.66,4.47 37.64,5.5 v35.8,5.5
LED  (via drill 0.3)
  Top 0.2: U5.4 19.25,14.05 14.6,9.4 11.8,9.4 v7.5,13.7 | v9.3,22.1 9.32,22.12 R11.2
  Bottom 0.2: v7.5,13.7 7.5,20.3 v9.3,22.1
N$1
  Bottom 1.016: RFCON1.P$3 U7.10
N$2
  Top 0.508: U1.5 35.16,42.67 C5.2
N$6
  Top 0.508: U1.6 36.83,42.02 35.68,40.88 C5.1
N$7
  Top 0.61: CON3.2 R19.1
N$8
  Top 0.61: CON4.2 R20.1
N$9
  Top 0.61: CON2.2 R18.1
N$10
  Top 0.61: CON5.2 R21.1
N$11
  Top 0.508: T1.1 6.16,23.26 6.4,23.5 R11.1
N$12
  Top 0.305: U2.1 21.9,33 22.36,32.53 L1.1
N$13
  Top 0.254: U2.4 21.6,34.5 22.18,35.08 R7.1
  Top 0.813: R7.1 R8.2
N$14
  Top 0.305: U2.6 17.5,35 16.8,35.7 C8.1
N$15
  Top 0.508: T1.3 2.53,27.58 D1.C
N$16
  Top 0.254: X1.2 21.2,10.4 20.25,11.35 U5.6
N$17
  Top 0.254: U5.7 20.75,14.35 21.4,13.7 23.7,13.7 24.5,12.9 X1.4
N$18
  Top 0.508: D1.A 7.1,27.6 7.68,27.02 R14.1
N$19
  Top 0.305: U5.26 15.45,18.75 15.18,19.02 L2.2
N$20
  Top 0.305: U5.29 15.65,17.25 13.92,15.52 C16.2
N$47
  Top 0.2: U3.3 12.05,44.95 11.7,44.6 8,44.6 7.55,45.05 U4.6
N$48
  Top 0.2: U3.1 13.95,46.95 13.5,47.4 9.9,47.4 9.45,46.95 U4.4
N$49
  Top 0.508: R6.1 13,41.82 U3.5
N$50
  Top 0.508: U3.2 13,45.2 13.4,44.8 15.4,44.8 16.12,45.52 R5.2
RFM_IRQ  (via drill 0.3)
  Top 0.2: U5.15 23.06,18.75 23.92,19.61 23.92,24.16 22.4,25.68 v22.4,29 | v19.7,38.6 v19.7,40.5 | v24.9,41.6 26.2,41.6 v29.3,38.5
  Bottom 0.2: v22.4,29 22.4,31.3 19.7,34 v19.7,38.6 | v19.7,40.5 23.8,40.5 v24.9,41.6 | v29.3,38.5 U7.2
RFM_RST  (via drill 0.3)
  Top 0.2: v30.9,41.9 31.52,42.52 R16.2 | U5.16 23.1,19.25 23.59,19.74 23.59,24.02 21.5,26.11 v21.5,29.9 | v18.5,38.6 v18.5,40.5
  Bottom 0.2: U7.1 31.35,41.45 v30.9,41.9 29.5,43.3 25.3,43.3 23.6,41.6 19.2,41.6 18.5,40.9 v18.5,40.5 | v21.5,29.9 21.5,31.2 18.5,34.2 v18.5,38.6
SWCLK  (via drill 0.3)
  Top 0.2: U5.1 17.75,14.15 16.3,12.7 v15.3,12.7
  Bottom 0.2: v15.3,12.7 6.21,12.7 TC1.4
  other vias: 5.13,13.77
SWDIO  (via drill 0.3)
  Top 0.2: U5.2 18.25,14.19 15.76,11.7 v15.3,11.7
  Bottom 0.2: v15.3,11.7 5.61,11.7 TC1.2
  other vias: 5.13,11.23
SWO  (via drill 0.3)
  Top 0.2: U5.3 18.75,14.22 14.62,10.1 v13.7,10.1
  Bottom 0.2: TC1.6 3.87,10.84 4.6,10.1 v13.7,10.1
  other vias: 3.87,15.04
US0_CLK  (via drill 0.3)
  Top 0.2: U5.18 20.75,20.81 22.94,23 22.94,23.75 19.6,27.09 v19.6,29 | v24.3,45.1 24.27,45.13 U6.6
  Bottom 0.2: v19.6,29 16.1,32.5 U7.12 10.7,32.5 10,33.2 10,35.7 9.1,36.6 9.1,43.3 11.4,45.6 23.8,45.6 v24.3,45.1
US0_MISO  (via drill 0.3)
  Top 0.2: U5.12 22.95,17.25 24.9,19.2 v24.9,25 | v27.1,43.93 27.16,43.87 U6.2
  Bottom 0.2: v24.9,25 15.4,34.5 U7.13 10.9,34.5 10.33,35.07 10.33,35.84 9.43,36.73 9.43,43.16 11.54,45.27 22.23,45.27 23.57,43.93 v27.1,43.93
US0_MOSI  (via drill 0.3)
  Top 0.2: U5.17 21.25,20.85 23.27,22.86 23.27,23.89 20.6,26.55 v20.6,30.8 | v20.4,44.7 20.4,46 20.8,46.41 U6.5
  Bottom 0.2: v20.6,30.8 20.5,30.8 14.8,36.5 U7.14 11,36.5 9.75,37.75 9.75,43.03 11.67,44.95 20.15,44.95 v20.4,44.7
VBAT  (via drill 0.3, 0.3 pad 1.2)
  Top 0.2: U2.2 v22.5,33.5 | v21.4,35.9 21,36.3 v17.7,36.3 | v14.9,37.6 14,38.5 C11.1
  Top 0.305: U2.9 17.6,33.5 17.35,33.75 17.6,34 U2.8
  Top 0.508: U1.3 40.98,42.02 40.5,42.5 v40.5,43.1
  Top 0.813: C4.1 14.77,32.45 | 14.77,32.45 C3.1 16.28,33.18 16.85,33.75 17.35,33.75 | v40.5,43.1 40.52,43.12 C1.1 C2.1 | C11.1 R6.2 12,38 v9.1,35.1 | R3.2 15.68,31.54 14.77,32.45
  Top 1.016: CON1.1 8.2,36 v9.1,35.1 11.75,32.45 C4.1
  Bottom 0.2: v22.5,33.5 22.5,34.8 v21.4,35.9 | v17.7,36.3 16.2,36.3 v14.9,37.6
  Bottom 1.016: v9.1,35.1 8.1,36.1 8.1,43.8 10.8,46.5 37.1,46.5 v40.5,43.1
VBAT_SENSE  (via drill 0.3)
  Top 0.2: U5.24 17.75,20.75 v17.4,21.1 | v18.6,26.4 C7.1
  Top 0.813: R3.1 R4.2 C7.1
  Bottom 0.2: v17.4,21.1 17.4,21.2 18.6,22.4 v18.6,26.4
VEXT  (via drill 0.3)
  Top 0.406: v44,41.4 43.98,41.38 U1.2
  Top 0.61: CON6.1 v43,34 42.5,34.5 CON2.1 37,34.5 36,33.5 C25.1 | CON7.1 v43,26.5 42.5,27 CON3.1 37,27 36,26 C24.1 | CON8.1 v43,19 42.5,19.5 CON4.1 37,19.5 36,18.5 C20.1 | CON9.1 v43,11.5 42.5,12 CON5.1 37,12 36,11 C19.1 | R22.2 R23.2 C6.1 40.68,6.78 v40.1,6.2
  Bottom 0.61: v40.1,6.2 43,9.1 v43,11.5 v43,19 v43,26.5 v43,34 43,40.4 v44,41.4
VEXT_EN  (via drill 0.3)
  Top 0.2: R1.2 37.12,44.68 v37.6,44.2 | 38.98,41.38 U1.7 | v39.4,41.8 38.98,41.38 | U5.32 16.45,15.75 16.2,15.5 v16.2,15.2 | v26.3,14.7 30,11 30,7 29.5,6.5 U9.5 | v38.8,39.5 38.98,39.67 38.98,41.38
  Bottom 0.2: v39.4,41.8 39.4,42.4 v37.6,44.2 | v16.2,15.2 18.2,13.2 24.8,13.2 v26.3,14.7 28,16.4 28,25.6 25.6,28 25.6,34.5 28.6,37.5 36.8,37.5 v38.8,39.5
VEXT_PGOOD  (via drill 0.3)
  Top 0.2: U1.1 40.52,40.73 v40.5,40.7 | v33.8,43.5 34.4,44.1 R2.1 | U5.31 16.18,16.25 v15.81,15.88
  Bottom 0.2: v40.5,40.7 38.2,40.7 | 38.2,40.7 35.4,43.5 v33.8,43.5 | v15.81,15.88 16.41,15.88 18.77,13.53 24.23,13.53 27.67,16.97 27.67,25.46 25.27,27.86 25.27,35.47 29.3,39.5 37,39.5 38.2,40.7

### Text on the board
tPlace: IoT Plant sense v1 / Jul 2019